# Altium schematic sheet child.SchDoc
size B
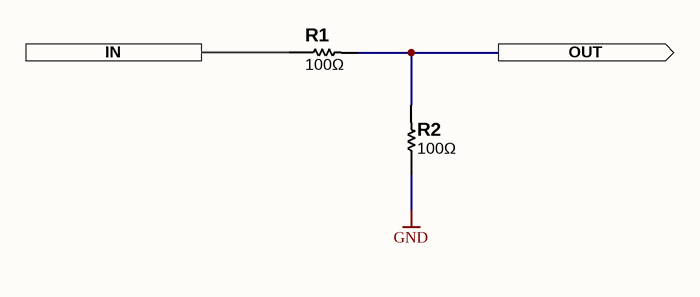
[diagram p0: child.SchDoc]

## Parts
R1  100Ω  [R0603_0.55MM_HD]
R2  100Ω  [R0603_0.55MM_HD]

## Ports
IN, OUT (out)

## Nets
GND: R2.1
IN: R1.1 ; port IN
OUT: R1.2 R2.2 ; port OUT

## Library data of the parts
R1 R2 = ERJ-3EKF1000V: RES 100 OHM 1/10W 1% 0603 SMD; Manufacturer 1: Panasonic Electronic Components; Limiting Element Voltage: 75; Maximum Overload Voltage: 150; Maximum Working Voltage: 3.2V; Package Power: 0603  (0.1W); Power (Watts): 0.1W- 1/10W; Resistance (Ohms): 100; Substitution Notes: 100 , ±1% , 0603 , AEC-Q200; Temperature Coefficient: ±100ppm/°C; classification: resistor_jellybean/R0603; id: 019a404e-f116-7b31-fcc9-d0885ee13048; kicad-footprint-path: footprints\R0603_0.55MM_HD.kicad_mod; kicad-symbol-path: symbols\R_2P.kicad_sym; Composition: Thick Film; Features: -; Height: 0.55MM; Manufacturer Part Number 1: ERJ-3EKF1000V; Number of Terminations: 2; Package: 0603 (1608 Metric); Packaging: Cut Tape (CT); Ratings: AEC-Q200; Sort Value: 100.0; Sort Value Package: 603_100; Supplier Package: 603; Tolerance: ±1%; cad-reference: ERJ-3EKF1000V; jlc_pn: C193336; kicad-footprint: R0603_0.55MM_HD; kicad-symbol: R_2P; manufacturer: Panasonic Electronic Components; mpn: ERJ-3EKF1000V; Value: 100Ω